# Altium schematic sheet Connector.SchDoc
size A4
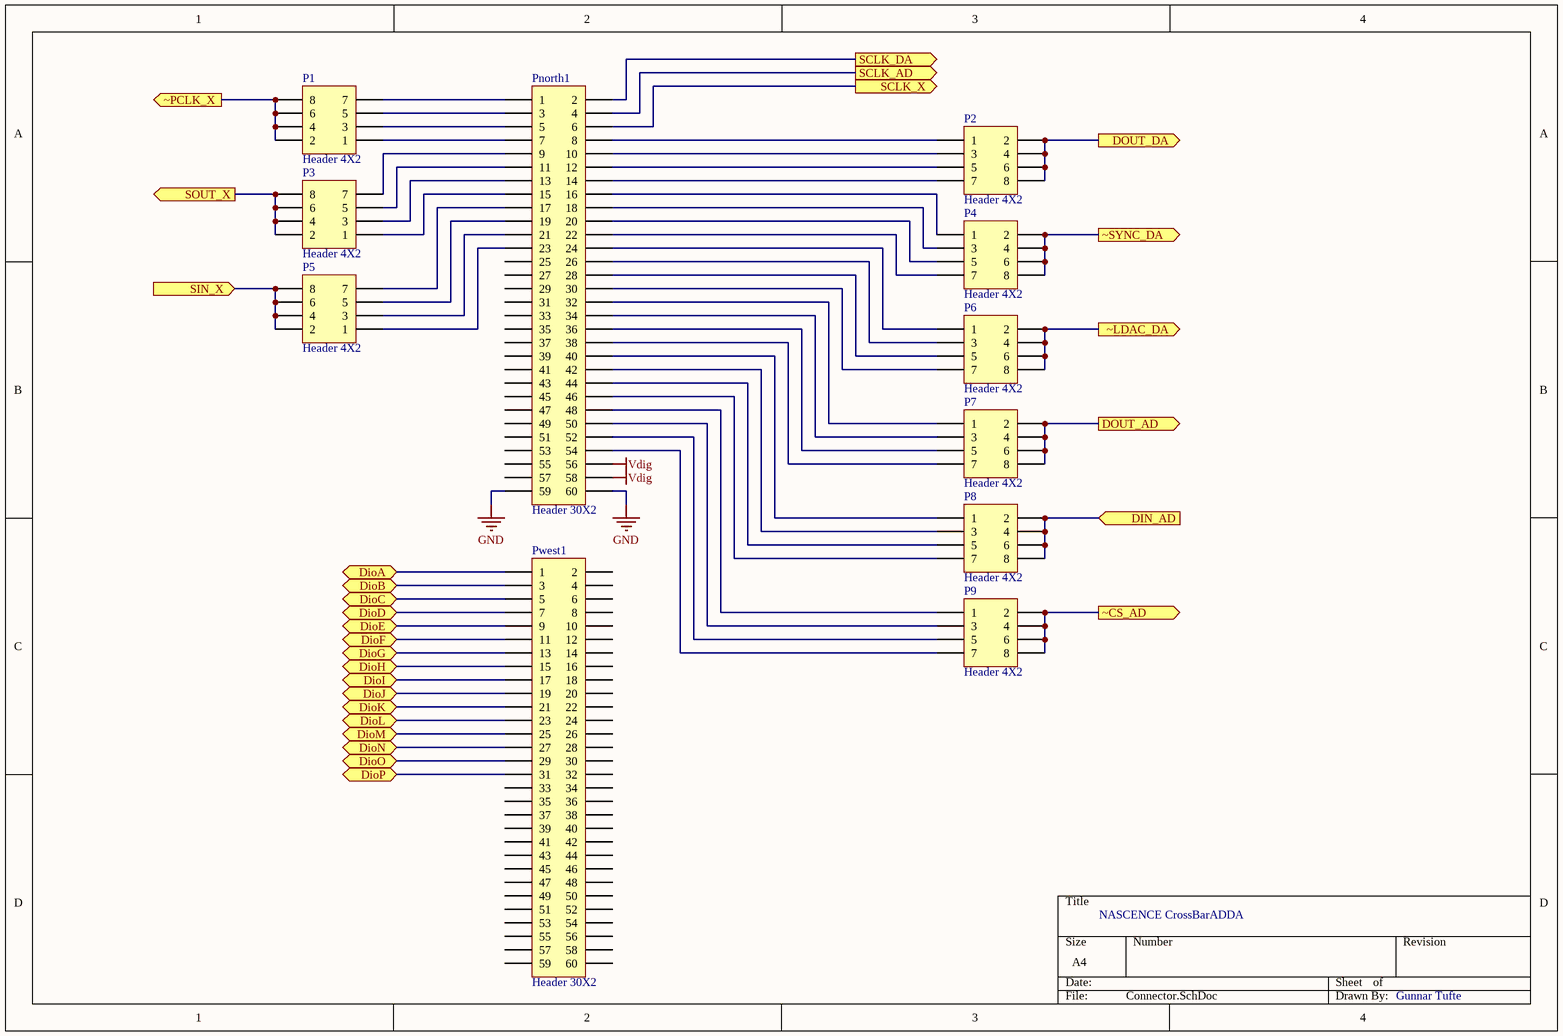
[diagram p0: Connector.SchDoc]

## Parts
P1  Header 4X2  [HDR2X4]
P2  Header 4X2  [HDR2X4]
P3  Header 4X2  [HDR2X4]
P4  Header 4X2  [HDR2X4]
P5  Header 4X2  [HDR2X4]
P6  Header 4X2  [HDR2X4]
P7  Header 4X2  [HDR2X4]
P8  Header 4X2  [HDR2X4]
P9  Header 4X2  [HDR2X4]
Pnorth1  Header 30X2  [HDR2X30]
Pwest1  Header 30X2  [HDR2X30]

## Ports
DIN_AD (in), DioA, DioB, DioC, DioD, DioE, DioF, DioG, DioH, DioI, DioJ, DioK, DioL, DioM, DioN, DioO, DioP, DOUT_AD (out), DOUT_DA (out), SCLK_AD (out), SCLK_DA (out), SCLK_X (out), SIN_X (in), SOUT_X (out), ~CS_AD (out), ~LDAC_DA (out), ~PCLK_X (out), ~SYNC_DA (out)

## Nets
GND: Pnorth1.59 Pnorth1.60
Vdig: Pnorth1.56 Pnorth1.58
DIN_AD: P8.2 P8.4 P8.6 P8.8 ; port DIN_AD
DioA: Pwest1.1 ; port DioA
DioB: Pwest1.3 ; port DioB
DioC: Pwest1.5 ; port DioC
DioD: Pwest1.7 ; port DioD
DioE: Pwest1.9 ; port DioE
DioF: Pwest1.11 ; port DioF
DioG: Pwest1.13 ; port DioG
DioH: Pwest1.15 ; port DioH
DioI: Pwest1.17 ; port DioI
DioJ: Pwest1.19 ; port DioJ
DioK: Pwest1.21 ; port DioK
DioL: Pwest1.23 ; port DioL
DioM: Pwest1.25 ; port DioM
DioN: Pwest1.27 ; port DioN
DioO: Pwest1.29 ; port DioO
DioP: Pwest1.31 ; port DioP
DOUT_AD: P7.2 P7.4 P7.6 P7.8 ; port DOUT_AD
DOUT_DA: P2.2 P2.4 P2.6 P2.8 ; port DOUT_DA
SCLK_AD: Pnorth1.4 ; port SCLK_AD
SCLK_DA: Pnorth1.2 ; port SCLK_DA
SCLK_X: Pnorth1.6 ; port SCLK_X
SIN_X: P5.2 P5.4 P5.6 P5.8 ; port SIN_X
SOUT_X: P3.2 P3.4 P3.6 P3.8 ; port SOUT_X
~CS_AD: P9.2 P9.4 P9.6 P9.8 ; port ~CS_AD
~LDAC_DA: P6.2 P6.4 P6.6 P6.8 ; port ~LDAC_DA
~PCLK_X: P1.2 P1.4 P1.6 P1.8 ; port ~PCLK_X
~SYNC_DA: P4.2 P4.4 P4.6 P4.8 ; port ~SYNC_DA
NetP1_1: P1.1 Pnorth1.7
NetP1_3: P1.3 Pnorth1.5
NetP1_5: P1.5 Pnorth1.3
NetP1_7: P1.7 Pnorth1.1
NetP2_1: P2.1 Pnorth1.8
NetP2_3: P2.3 Pnorth1.10
NetP2_5: P2.5 Pnorth1.12
NetP2_7: P2.7 Pnorth1.14
NetP3_1: P3.1 Pnorth1.15
NetP3_3: P3.3 Pnorth1.13
NetP3_5: P3.5 Pnorth1.11
NetP3_7: P3.7 Pnorth1.9
NetP4_1: P4.1 Pnorth1.16
NetP4_3: P4.3 Pnorth1.18
NetP4_5: P4.5 Pnorth1.20
NetP4_7: P4.7 Pnorth1.22
NetP5_1: P5.1 Pnorth1.23
NetP5_3: P5.3 Pnorth1.21
NetP5_5: P5.5 Pnorth1.19
NetP5_7: P5.7 Pnorth1.17
NetP6_1: P6.1 Pnorth1.24
NetP6_3: P6.3 Pnorth1.26
NetP6_5: P6.5 Pnorth1.28
NetP6_7: P6.7 Pnorth1.30
NetP7_1: P7.1 Pnorth1.32
NetP7_3: P7.3 Pnorth1.34
NetP7_5: P7.5 Pnorth1.36
NetP7_7: P7.7 Pnorth1.38
NetP8_1: P8.1 Pnorth1.40
NetP8_3: P8.3 Pnorth1.42
NetP8_5: P8.5 Pnorth1.44
NetP8_7: P8.7 Pnorth1.46
NetP9_1: P9.1 Pnorth1.48
NetP9_3: P9.3 Pnorth1.50
NetP9_5: P9.5 Pnorth1.52
NetP9_7: P9.7 Pnorth1.54

Not connected (* = marked no-connect by the designer): Pnorth1 25 27 29 31 33 35 37 39 41 43 45 47 49 51 53 55 57; Pwest1 2 4 6 8 10 12 14 16 18 20 22 24 26 28 30 32 33 34 35 36 37 38 39 40 41 42 43 44 45 46 47 48 49 50 51 52 53 54 55 56 57 58 59 60

## Notes on the sheet
- NASCENCE CrossBarADDA
- Gunnar Tufte

## Library data of the parts
P1-P9 = Header 4X2: Header, 4-Pin, Dual row; LatestRevisionDate: 17-Jul-2002; LatestRevisionNote: Re-released for DXP Platform.; Publisher: Altium Limited
Pnorth1 Pwest1 = Header 30X2: Header, 30-Pin, Dual row; LatestRevisionDate: 17-Jul-2002; LatestRevisionNote: Re-released for DXP Platform.; Publisher: Altium Limited